# Altium schematic sheet Sheet1.SchDoc
size E
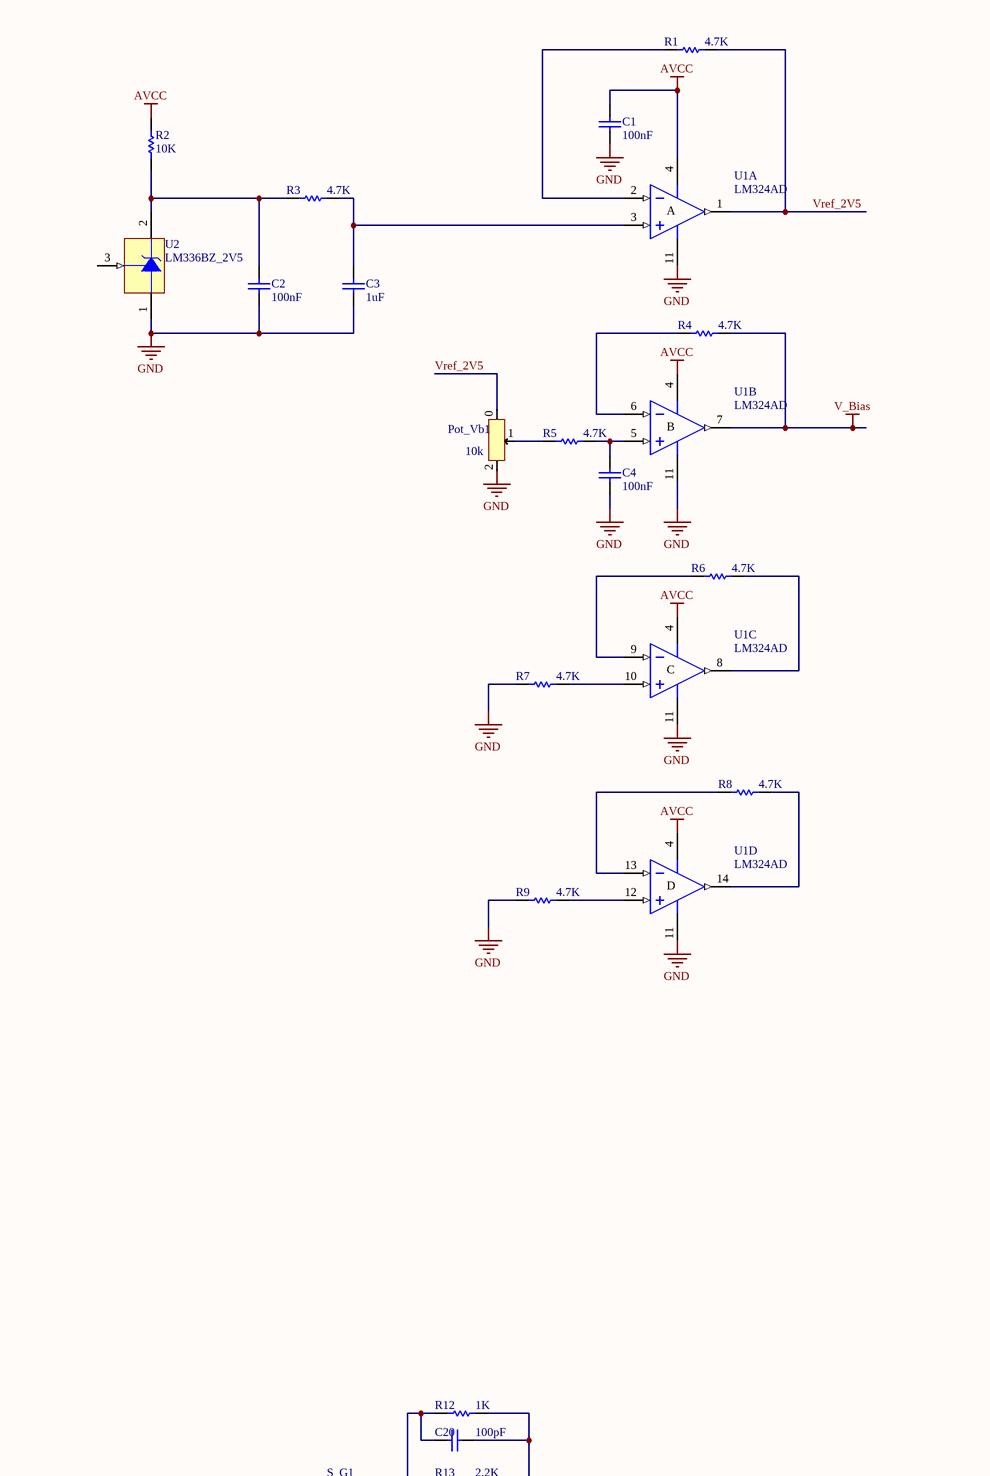
[diagram p0: Sheet1.SchDoc, top left]
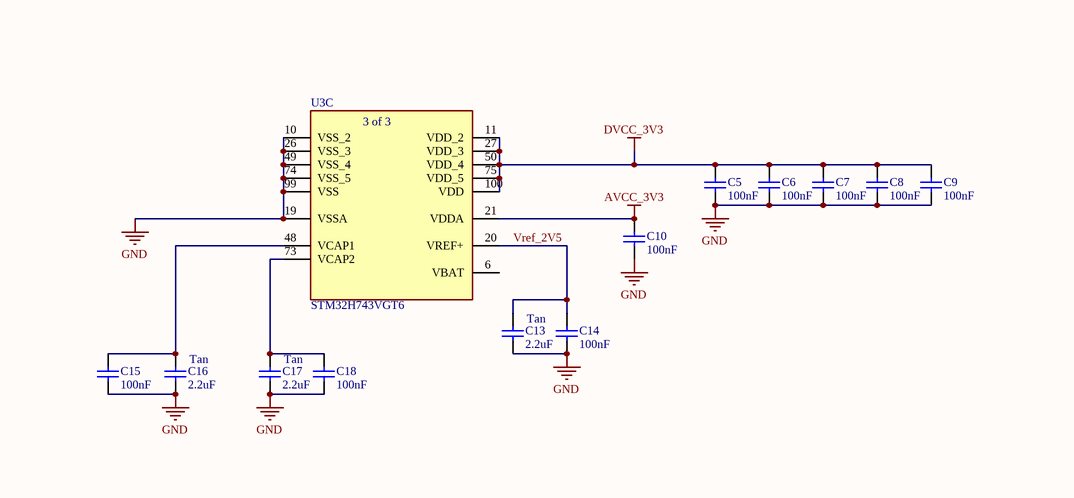
[diagram p1: Sheet1.SchDoc, top middle]
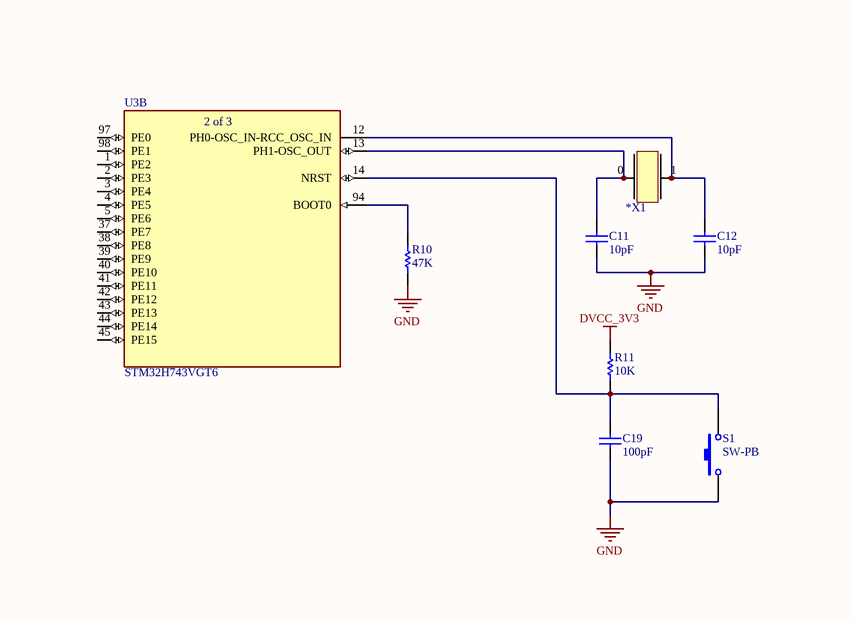
[diagram p2: Sheet1.SchDoc, top right]
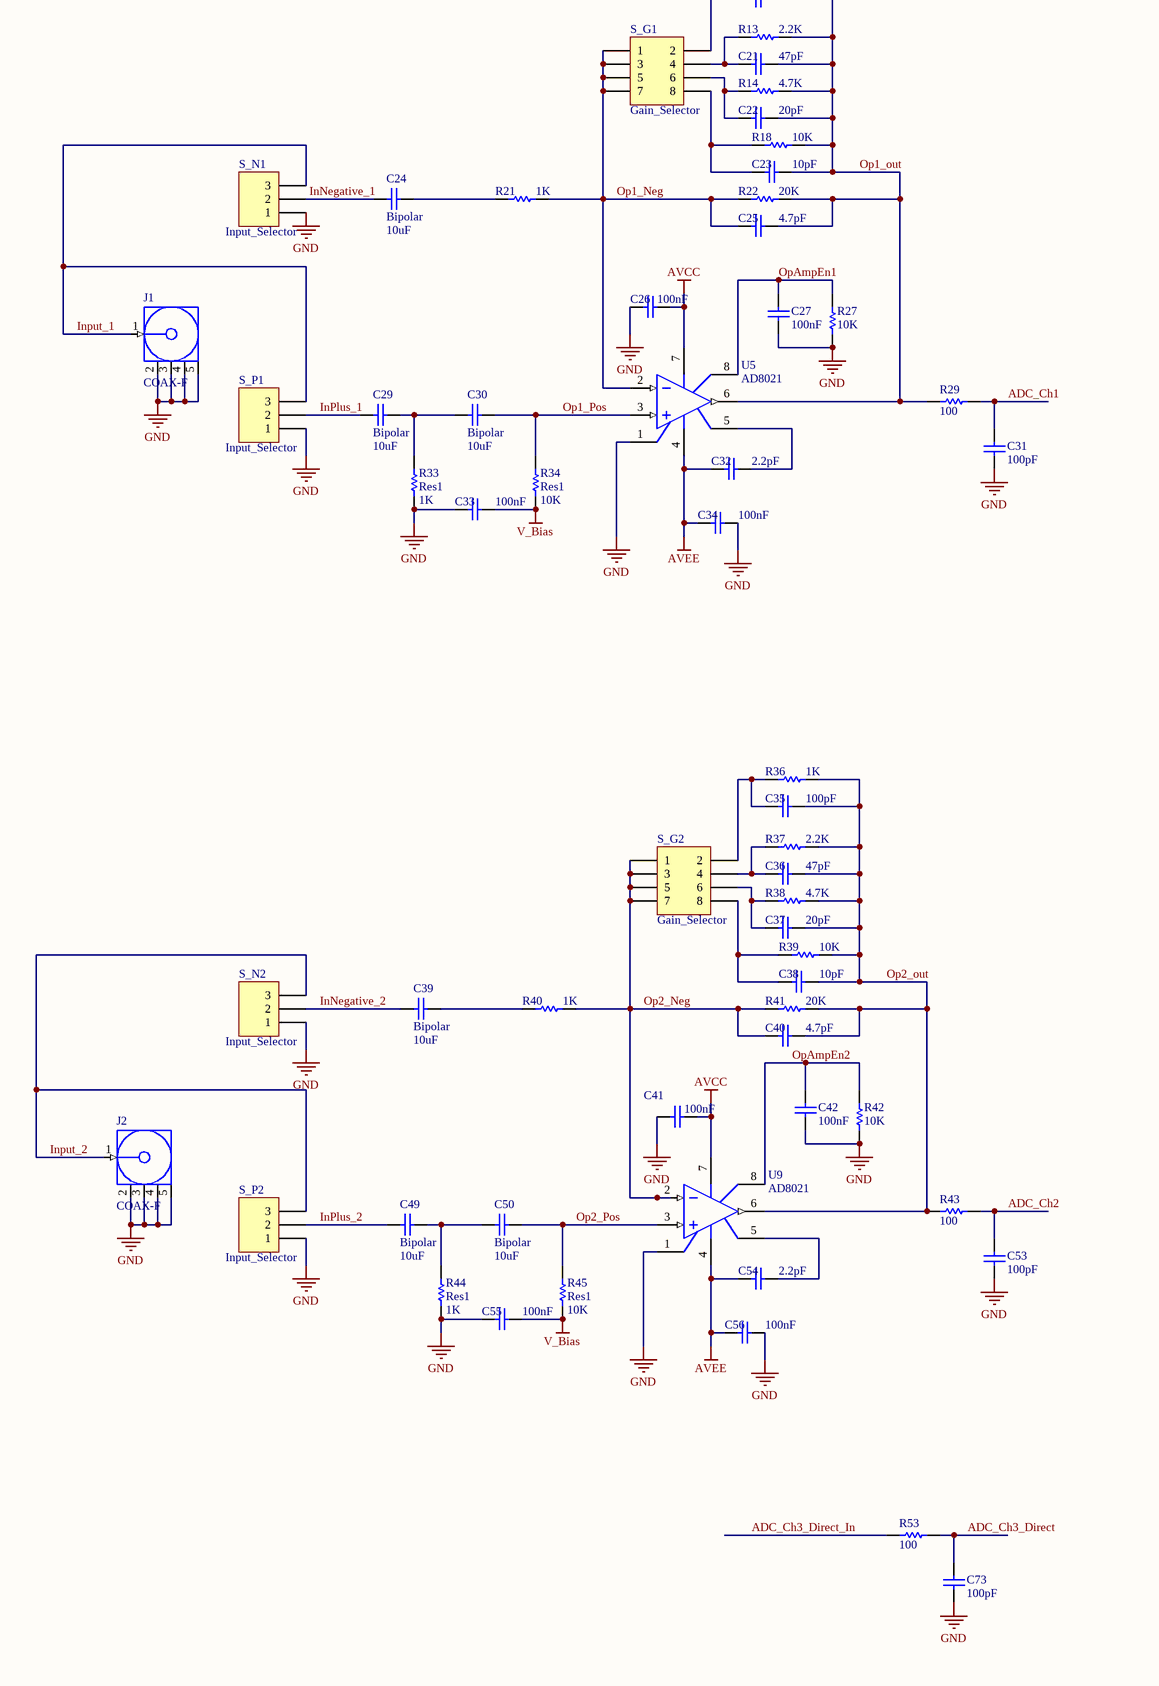
[diagram p3: Sheet1.SchDoc, bottom left]
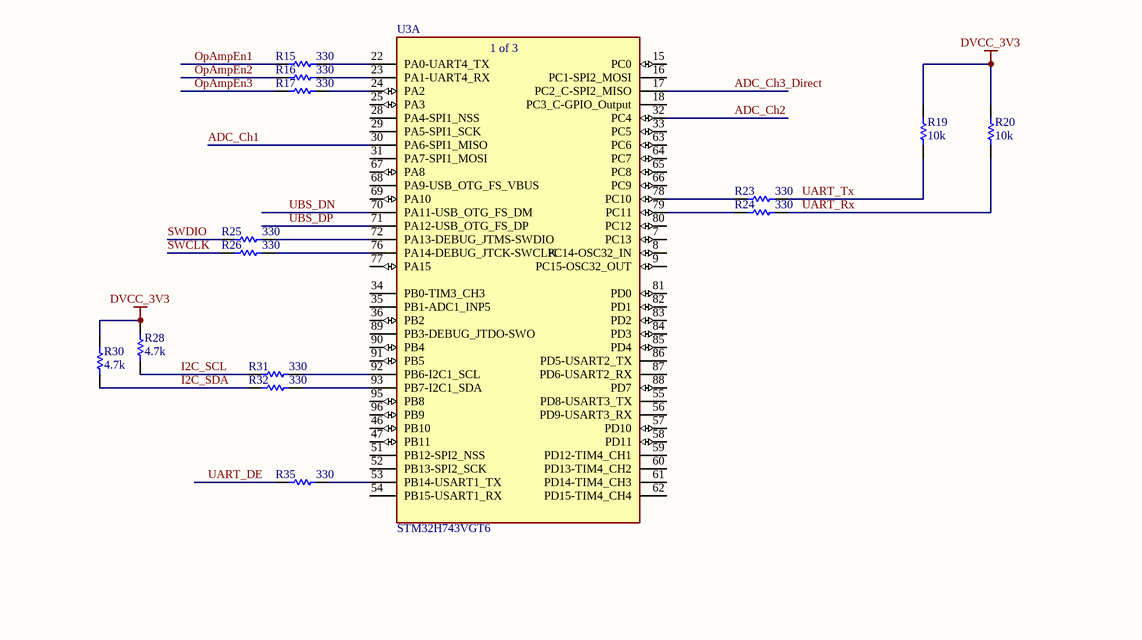
[diagram p4: Sheet1.SchDoc, bottom middle]
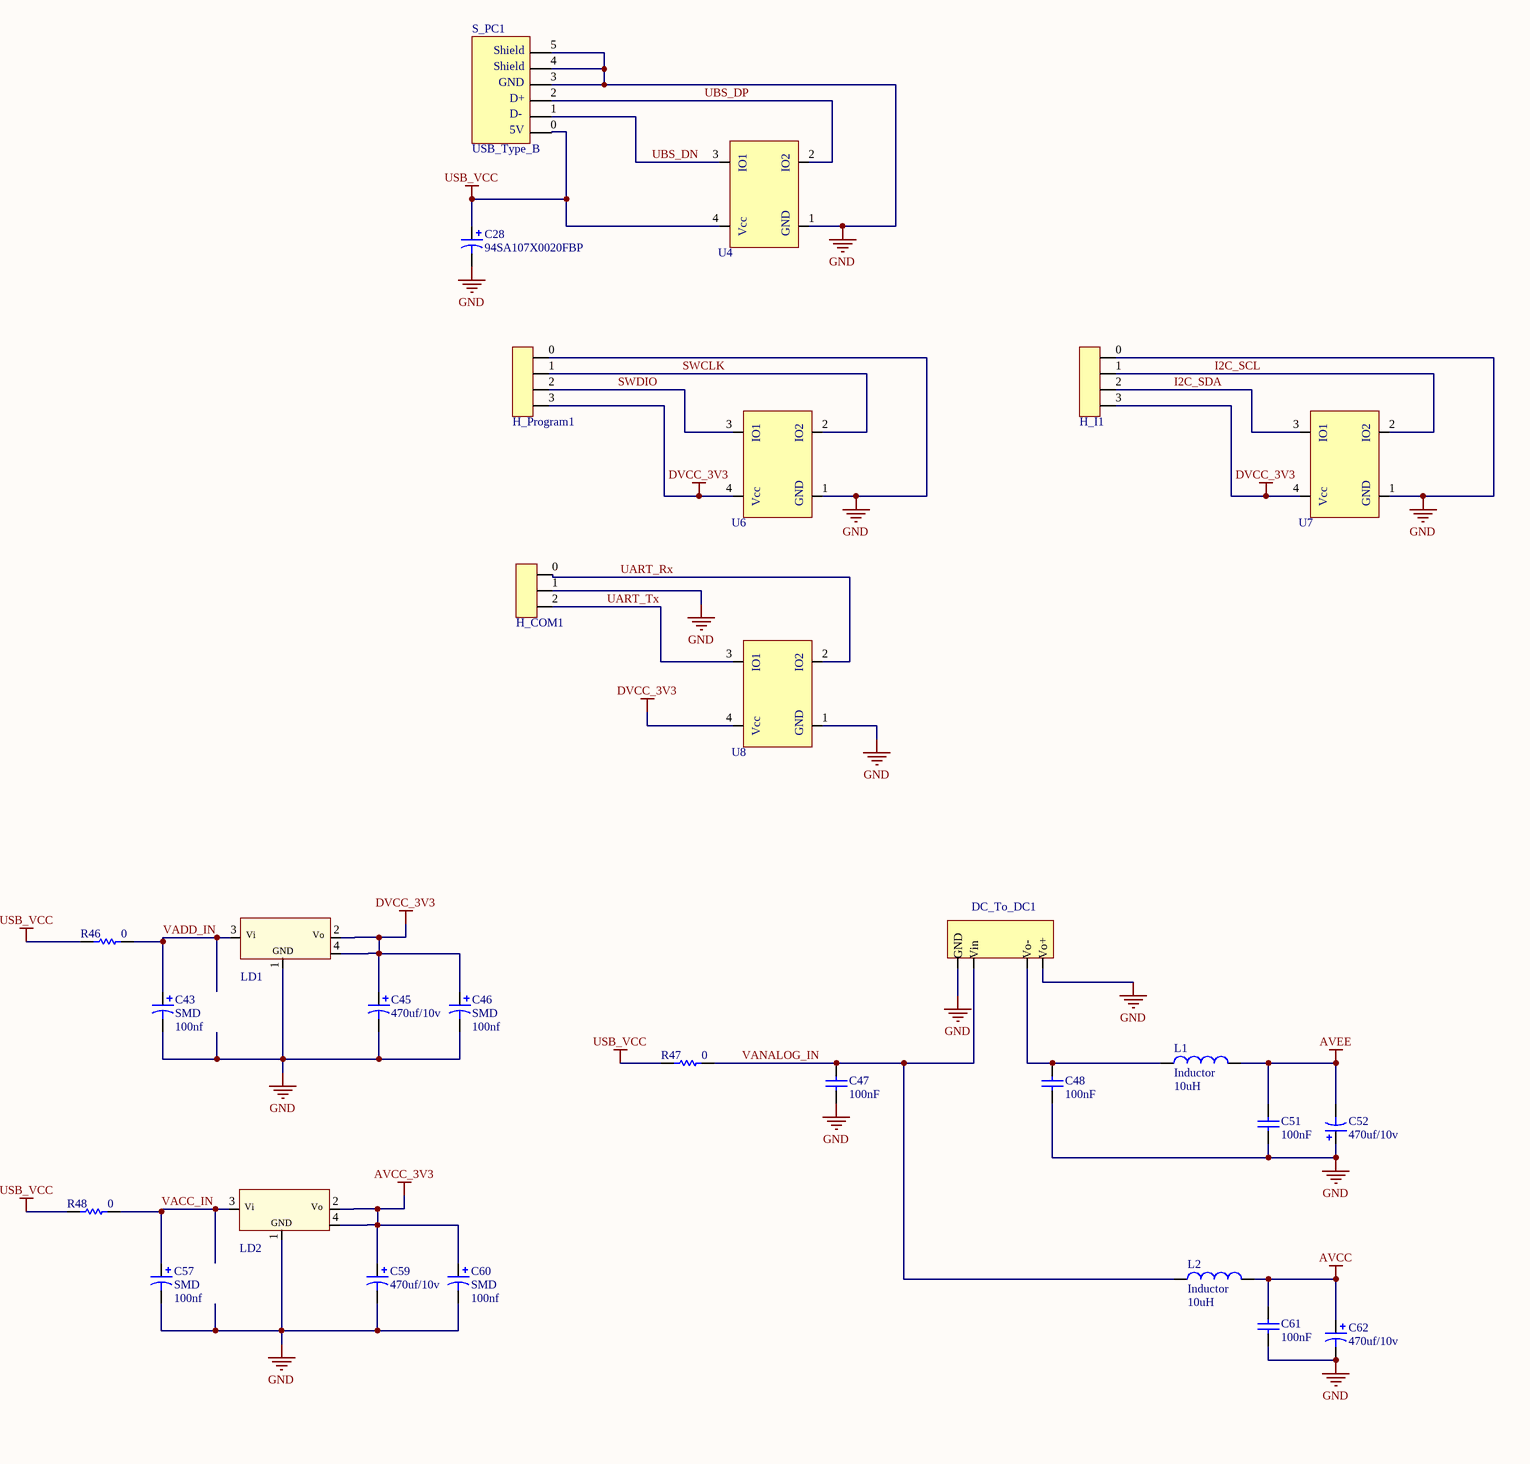
[diagram p5: Sheet1.SchDoc, bottom right]

## Parts
*X1  XTAl_Large  [XTAL_Large]  (value not drawn)
C1  value 100nF  [C0805]  (hidden comment: Bipolar)
C2  value 100nF  [C0805]  (hidden comment: Bipolar)
C3  value 1uF  [C0805]  (hidden comment: Bipolar)
C4  value 100nF  [C0805]  (hidden comment: Bipolar)
C5  value 100nF  [C0805]  (hidden comment: Bipolar)
C6  value 100nF  [C0805]  (hidden comment: Bipolar)
C7  value 100nF  [C0805]  (hidden comment: Bipolar)
C8  value 100nF  [C0805]  (hidden comment: Bipolar)
C9  value 100nF  [C0805]  (hidden comment: Bipolar)
C10  value 100nF  [C0805]  (hidden comment: Bipolar)
C11  value 10pF  [C0805]  (hidden comment: Bipolar)
C12  value 10pF  [C0805]  (hidden comment: Bipolar)
C13  Tan  value 2.2uF  [C1210]
C14  value 100nF  [C0805]  (hidden comment: Bipolar)
C15  value 100nF  [C0805]  (hidden comment: Bipolar)
C16  Tan  value 2.2uF  [C1210]
C17  Tan  value 2.2uF  [C1210]
C18  value 100nF  [C0805]  (hidden comment: Bipolar)
C19  value 100pF  [C0805]  (hidden comment: Bipolar)
C20  value 100pF  [C0805]  (hidden comment: Bipolar)
C21  value 47pF  [C0805]  (hidden comment: Bipolar)
C22  value 20pF  [C0805]  (hidden comment: Bipolar)
C23  value 10pF  [C0805]  (hidden comment: Bipolar)
C24  Bipolar  value 10uF  [HA-N3]
C25  value 4.7pF  [C0805]  (hidden comment: Bipolar)
C26  value 100nF  [C0805]  (hidden comment: Bipolar)
C27  value 100nF  [C0805]  (hidden comment: Bipolar)
C28  94SA107X0020FBP  [F]
C29  Bipolar  value 10uF  [HA-N3]
C30  Bipolar  value 10uF  [HA-N3]
C31  value 100pF  [C0805]  (hidden comment: Bipolar)
C32  value 2.2pF  [C0805]  (hidden comment: Bipolar)
C33  value 100nF  [C0805]  (hidden comment: Bipolar)
C34  value 100nF  [C0805]  (hidden comment: Bipolar)
C35  value 100pF  [C0805]  (hidden comment: Bipolar)
C36  value 47pF  [C0805]  (hidden comment: Bipolar)
C37  value 20pF  [C0805]  (hidden comment: Bipolar)
C38  value 10pF  [C0805]  (hidden comment: Bipolar)
C39  Bipolar  value 10uF  [HA-N3]
C40  value 4.7pF  [C0805]  (hidden comment: Bipolar)
C41  value 100nF  [C0805]  (hidden comment: Bipolar)
C42  value 100nF  [C0805]  (hidden comment: Bipolar)
C43  SMD  value 100nf  [C0805]
C45  470uf/10v  [CAPPR3.5-8X11.5]
C46  SMD  value 100nf  [C0805]
C47  value 100nF  [C0805]  (hidden comment: Bipolar)
C48  value 100nF  [C0805]  (hidden comment: Bipolar)
C49  Bipolar  value 10uF  [HA-N3]
C50  Bipolar  value 10uF  [HA-N3]
C51  value 100nF  [C0805]  (hidden comment: Bipolar)
C52  470uf/10v  [CAPPR3.5-8X11.5]
C53  value 100pF  [C0805]  (hidden comment: Bipolar)
C54  value 2.2pF  [C0805]  (hidden comment: Bipolar)
C55  value 100nF  [C0805]  (hidden comment: Bipolar)
C56  value 100nF  [C0805]  (hidden comment: Bipolar)
C57  SMD  value 100nf  [C0805]
C59  470uf/10v  [CAPPR3.5-8X11.5]
C60  SMD  value 100nf  [C0805]
C61  value 100nF  [C0805]  (hidden comment: Bipolar)
C62  470uf/10v  [CAPPR3.5-8X11.5]
C73  value 100pF  [C0805]  (hidden comment: Bipolar)
DC_To_DC1  DC_To_DC  [DC_To_DC]  (value not drawn)
H_COM1  Header_3Pin  [Header_3Pin]  (value not drawn)
H_I1  Header_4Pin  [Header_4Pin]  (value not drawn)
H_Program1  Header_4Pin  [Header_4Pin]  (value not drawn)
J1  COAX-F  [MCX5.08-H5]
J2  COAX-F  [MCX5.08-H5]
L1  Inductor  value 10uH  [6-0805_M]
L2  Inductor  value 10uH  [6-0805_M]
LD1  LD33  [SOT230P]  (value not drawn)
LD2  LD33  [SOT230P]  (value not drawn)
Pot_Vb1  10k  [MultiTurn]
R1  value 4.7K  [6-0805_L]  (hidden comment: Res1)
R2  value 10K  [6-0805_L]  (hidden comment: Res1)
R3  value 4.7K  [6-0805_L]  (hidden comment: Res1)
R4  value 4.7K  [6-0805_L]  (hidden comment: Res1)
R5  value 4.7K  [6-0805_L]  (hidden comment: Res1)
R6  value 4.7K  [6-0805_L]  (hidden comment: Res1)
R7  value 4.7K  [6-0805_L]  (hidden comment: Res1)
R8  value 4.7K  [6-0805_L]  (hidden comment: Res1)
R9  value 4.7K  [6-0805_L]  (hidden comment: Res1)
R10  value 47K  [6-0805_L]  (hidden comment: Res1)
R11  value 10K  [6-0805_L]  (hidden comment: Res1)
R12  value 1K  [6-0805_L]  (hidden comment: Res1)
R13  value 2.2K  [6-0805_L]  (hidden comment: Res1)
R14  value 4.7K  [6-0805_L]  (hidden comment: Res1)
R15  value 330  [6-0805_L]  (hidden comment: Res1)
R16  value 330  [6-0805_L]  (hidden comment: Res1)
R17  value 330  [6-0805_L]  (hidden comment: Res1)
R18  value 10K  [6-0805_L]  (hidden comment: Res1)
R19  value 10k  [6-0805_L]  (hidden comment: Res1)
R20  value 10k  [6-0805_L]  (hidden comment: Res1)
R21  value 1K  [6-0805_L]  (hidden comment: Res1)
R22  value 20K  [6-0805_L]  (hidden comment: Res1)
R23  value 330  [6-0805_L]  (hidden comment: Res1)
R24  value 330  [6-0805_L]  (hidden comment: Res1)
R25  value 330  [6-0805_L]  (hidden comment: Res1)
R26  value 330  [6-0805_L]  (hidden comment: Res1)
R27  value 10K  [6-0805_L]  (hidden comment: Res1)
R28  value 4.7k  [6-0805_L]  (hidden comment: Res1)
R29  value 100  [6-0805_L]  (hidden comment: Res1)
R30  value 4.7k  [6-0805_L]  (hidden comment: Res1)
R31  value 330  [6-0805_L]  (hidden comment: Res1)
R32  value 330  [6-0805_L]  (hidden comment: Res1)
R33  Res1  value 1K  [6-0805_L]
R34  Res1  value 10K  [6-0805_L]
R35  value 330  [6-0805_L]  (hidden comment: Res1)
R36  value 1K  [6-0805_L]  (hidden comment: Res1)
R37  value 2.2K  [6-0805_L]  (hidden comment: Res1)
R38  value 4.7K  [6-0805_L]  (hidden comment: Res1)
R39  value 10K  [6-0805_L]  (hidden comment: Res1)
R40  value 1K  [6-0805_L]  (hidden comment: Res1)
R41  value 20K  [6-0805_L]  (hidden comment: Res1)
R42  value 10K  [6-0805_L]  (hidden comment: Res1)
R43  value 100  [6-0805_L]  (hidden comment: Res1)
R44  Res1  value 1K  [6-0805_L]
R45  Res1  value 10K  [6-0805_L]
R46  value 0  [6-0805_L]  (hidden comment: Res1)
R47  value 0  [6-0805_L]  (hidden comment: Res1)
R48  value 0  [6-0805_L]  (hidden comment: Res1)
R53  value 100  [6-0805_L]  (hidden comment: Res1)
S1  SW-PB  [SPST-2]
S_G1  Gain_Selector  [HDR2X4]
S_G2  Gain_Selector  [HDR2X4]
S_N1  Input_Selector  [HDR1X3]
S_N2  Input_Selector  [HDR1X3]
S_P1  Input_Selector  [HDR1X3]
S_P2  Input_Selector  [HDR1X3]
S_PC1  USB_Type_B  [USB_Type_B]
U1  LM324AD  [SO14_N]  (parts A,B,C,D of 4)
U2  LM336BZ_2V5  [TO92]
U3  STM32H743VGT6  [QFP50P1600X1600X160-100N]  (parts A,B,C of 3)
U4  PRTR5V  [SOT143L]  (value not drawn)
U5  AD8021  [SO8_N]
U6  PRTR5V  [SOT143L]  (value not drawn)
U7  PRTR5V  [SOT143L]  (value not drawn)
U8  PRTR5V  [SOT143L]  (value not drawn)
U9  AD8021  [SO8_N]

## Nets
AVCC: C1.2 C26.2 C41.2 C61.2 C62.1 L2.2 R2.2 U1.4(V+) U5.7(V+) U9.7(V+)
AVCC_3V3: C10.2 C59.1 C60.1 LD2.2(Vo) LD2.4(Vo) U3.21(VDDA)
AVEE: C32.1 C34.1 C51.2 C52.2 C54.1 C56.1 L1.2 U5.4(V-) U9.4(V-)
DVCC_3V3: C5.2 C6.2 C7.2 C8.2 C9.2 C45.1 C46.1 H_I1.3 H_Program1.3 LD1.2(Vo) LD1.4(Vo) R11.2 R19.2 R20.2 R28.2 R30.2 U3.11(VDD_2) U3.27(VDD_3) U3.50(VDD_4) U3.75(VDD_5) U3.100(VDD) U6.4 U7.4 U8.4
GND: C1.1 C2.1 C3.1 C4.1 C5.1 C6.1 C7.1 C8.1 C9.1 C10.1 C11.1 C12.1 C13.1 C14.1 C15.1 C16.1 C17.1 C18.1 C19.1 C26.1 C27.1 C28.2 C31.1 C33.1 C34.2 C41.1 C42.1 C43.2 C45.2 C46.2 C47.1 C48.1 C51.1 C52.1 C53.1 C55.1 C56.2 C57.2 C59.2 C60.2 C61.1 C62.2 C73.1 DC_To_DC1.0(GND) DC_To_DC1.3(Vo+) H_COM1.1 H_I1.0 H_Program1.0 J1.2(GND) J1.3(GND) J1.4(GND) J1.5(GND) J2.2(GND) J2.3(GND) J2.4(GND) J2.5(GND) LD1.1(GND) LD2.1(GND) Pot_Vb1.2 R7.1 R9.1 R10.2 R27.1 R33.1 R42.1 R44.1 S1.1 S_N1.1 S_N2.1 S_P1.1 S_P2.1 S_PC1.3 S_PC1.4 S_PC1.5 U1.11(V-) U2.1(-V) U3.10(VSS_2) U3.19(VSSA) U3.26(VSS_3) U3.49(VSS_4) U3.74(VSS_5) U3.99(VSS) U4.1 U5.1(OS_NULL) U6.1 U7.1 U8.1 U9.1(OS_NULL)
USB_VCC: C28.1 R46.1 R47.1 R48.1 S_PC1.0 U4.4
V_Bias: C33.2 C55.2 R4.2 R34.1 R45.1 U1.7(OUT)
ADC_Ch1: C31.2 R29.1 U3.30(PA6-SPI1_MISO)
ADC_Ch2: C53.2 R43.1 U3.32(PC4)
ADC_Ch3_Direct: C73.2 R53.1 U3.17(PC2_C-SPI2_MISO)
ADC_Ch3_Direct_In: R53.2
I2C_SCL: H_I1.1 R28.1 R31.1 U7.2
I2C_SDA: H_I1.2 R30.1 R32.1 U7.3
InNegative_1: C24.1 S_N1.2
InNegative_2: C39.1 S_N2.2
InPlus_1: C29.1 S_P1.2
InPlus_2: C49.1 S_P2.2
Input_1: J1.1(Signal) S_N1.3 S_P1.3
Input_2: J2.1(Signal) S_N2.3 S_P2.3
Op1_Neg: C25.1 R21.2 R22.1 S_G1.1 S_G1.3 S_G1.5 S_G1.7 U5.2(IN-)
Op1_out: C20.2 C21.2 C22.2 C23.2 C25.2 R12.2 R13.2 R14.2 R18.2 R22.2 R29.2 U5.6(OUT)
Op1_Pos: C30.2 R34.2 U5.3(IN+)
Op2_Neg: C40.1 R40.2 R41.1 S_G2.1 S_G2.3 S_G2.5 S_G2.7 U9.2(IN-)
Op2_out: C35.2 C36.2 C37.2 C38.2 C40.2 R36.2 R37.2 R38.2 R39.2 R41.2 R43.2 U9.6(OUT)
Op2_Pos: C50.2 R45.2 U9.3(IN+)
OpAmpEn1: C27.2 R15.1 R27.2 U5.8(NC)
OpAmpEn2: C42.2 R16.1 R42.2 U9.8(NC)
OpAmpEn3: R17.1
SWCLK: H_Program1.1 R26.1 U6.2
SWDIO: H_Program1.2 R25.1 U6.3
UART_DE: R35.1
UART_Rx: H_COM1.0 R20.1 R24.2 U8.2
UART_Tx: H_COM1.2 R19.1 R23.2 U8.3
UBS_DN: S_PC1.1 U3.70(PA11-USB_OTG_FS_DM) U4.3
UBS_DP: S_PC1.2 U3.71(PA12-USB_OTG_FS_DP) U4.2
VACC_IN: C57.1 LD2.3(Vi) R48.2
VADD_IN: C43.1 LD1.3(Vi) R46.2
VANALOG_IN: C47.2 DC_To_DC1.1(Vin) L2.1 R47.2
Vref_2V5: C13.2 C14.2 Pot_Vb1.0 R1.2 U1.1(OUT) U3.20(VREF+)
Net*X1_0: *X1.0 C11.2 U3.13(PH1-OSC_OUT)
Net*X1_1: *X1.1 C12.2 U3.12(PH0-OSC_IN-RCC_OSC_IN)
NetC2_2: C2.2 R2.1 R3.1 U2.2(+V)
NetC3_2: C3.2 R3.2 U1.3(IN+)
NetC4_2: C4.2 R5.2 U1.5(IN+)
NetC15_2: C15.2 C16.2 U3.48(VCAP1)
NetC17_2: C17.2 C18.2 U3.73(VCAP2)
NetC19_2: C19.2 R11.1 S1.2 U3.14(NRST)
NetC20_1: C20.1 R12.1 S_G1.2
NetC21_1: C21.1 R13.1 S_G1.4
NetC22_1: C22.1 R14.1 S_G1.6
NetC23_1: C23.1 R18.1 S_G1.8
NetC24_2: C24.2 R21.1
NetC29_2: C29.2 C30.1 R33.2
NetC32_2: C32.2 U5.5(OS_NULL)
NetC35_1: C35.1 R36.1 S_G2.2
NetC36_1: C36.1 R37.1 S_G2.4
NetC37_1: C37.1 R38.1 S_G2.6
NetC38_1: C38.1 R39.1 S_G2.8
NetC39_2: C39.2 R40.1
NetC48_2: C48.2 DC_To_DC1.2(Vo-) L1.1
NetC49_2: C49.2 C50.1 R44.2
NetC54_2: C54.2 U9.5(OS_NULL)
NetPot_Vb1_1: Pot_Vb1.1 R5.1
NetR1_1: R1.1 U1.2(IN-)
NetR4_1: R4.1 U1.6(IN-)
NetR6_1: R6.1 U1.9(IN-)
NetR6_2: R6.2 U1.8(OUT)
NetR7_2: R7.2 U1.10(IN+)
NetR8_1: R8.1 U1.13(IN-)
NetR8_2: R8.2 U1.14(OUT)
NetR9_2: R9.2 U1.12(IN+)
NetR10_1: R10.1 U3.94(BOOT0)
NetR15_2: R15.2 U3.22(PA0-UART4_TX)
NetR16_2: R16.2 U3.23(PA1-UART4_RX)
NetR17_2: R17.2 U3.24(PA2)
NetR23_1: R23.1 U3.78(PC10)
NetR24_1: R24.1 U3.79(PC11)
NetR25_2: R25.2 U3.72(PA13-DEBUG_JTMS-SWDIO)
NetR26_2: R26.2 U3.76(PA14-DEBUG_JTCK-SWCLK)
NetR31_2: R31.2 U3.92(PB6-I2C1_SCL)
NetR32_2: R32.2 U3.93(PB7-I2C1_SDA)
NetR35_2: R35.2 U3.53(PB14-USART1_TX)

Not connected (* = marked no-connect by the designer): U2 3(ADJ); U3 1(PE2) 2(PE3) 3(PE4) 4(PE5) 5(PE6) 6(VBAT) 7(PC13) 8(PC14-OSC32_IN) 9(PC15-OSC32_OUT) 15(PC0) 16(PC1-SPI2_MOSI) 18(PC3_C-GPIO_Output) 25(PA3) 28(PA4-SPI1_NSS) 29(PA5-SPI1_SCK) 31(PA7-SPI1_MOSI) 33(PC5) 34(PB0-TIM3_CH3) 35(PB1-ADC1_INP5) 36(PB2) 37(PE7) 38(PE8) 39(PE9) 40(PE10) 41(PE11) 42(PE12) 43(PE13) 44(PE14) 45(PE15) 46(PB10) 47(PB11) 51(PB12-SPI2_NSS) 52(PB13-SPI2_SCK) 54(PB15-USART1_RX) 55(PD8-USART3_TX) 56(PD9-USART3_RX) 57(PD10) 58(PD11) 59(PD12-TIM4_CH1) 60(PD13-TIM4_CH2) 61(PD14-TIM4_CH3) 62(PD15-TIM4_CH4) 63(PC6) 64(PC7) 65(PC8) 66(PC9) 67(PA8) 68(PA9-USB_OTG_FS_VBUS) 69(PA10) 77(PA15) 80(PC12) 81(PD0) 82(PD1) 83(PD2) 84(PD3) 85(PD4) 86(PD5-USART2_TX) 87(PD6-USART2_RX) 88(PD7) 89(PB3-DEBUG_JTDO-SWO) 90(PB4) 91(PB5) 95(PB8) 96(PB9) 97(PE0) 98(PE1)

## Notes on the sheet
- (in symbol LM324AD, part A) A
- (in symbol LM324AD, part B) B
- (in symbol LM324AD, part C) C
- (in symbol LM324AD, part D) D
- (in symbol PRTR5V) IO1; IO2; Vcc; GND
- (in symbol STM32H743VGT6, part A) 1 of 3
- (in symbol STM32H743VGT6, part B) 2 of 3
- (in symbol STM32H743VGT6, part C) 3 of 3
- (in symbol USB_Type_B) Shield; GND; D+; D-; 5V

## Library data of the parts
C1-C27 C29-C42 C47-C51 C53-C56 C61 C73 = Cap: Capacitor; Published: 8-Jun-2000; LatestRevisionDate: 17-Jul-2002; LatestRevisionNote: Re-released for DXP Platform.; PackageReference: RAD-0.3; Publisher: Altium Limited; PackageDescription: Radial Cap, Thru-Hole; 2 Leads; 0.3 in Pin Spacing
C28 = 94SA107X0020FBP: Solid Aluminum Capacitor with Organic Semiconductor Electrolyte: 100uF, 20V, Bulk Pack; Note: Part Numbers shown are for ± 20% capacitance tolerance (X0).; PCB_Layout: Complies with Manufacturer's Recommendation.; DrillSize: Nominal, Rounded to the nearest 0.1mm; Published: 19-Mar-2004; DatasheetDocument: 29-Jun-2001; PackageReference: F; Publisher: Altium Limited; ComponentLink1Description: Manufacturer Link; ComponentLink1URL: http://www.vishay.com/; ComponentLink2Description: Datasheet; ComponentLink2URL: http://www.vishay.com/docs/90003/94sa.pdf; Value: 100uF
C43 C46 C57 C60 = Cap Pol3: Polarized Capacitor (Surface Mount); Published: 8-Jun-2000; LatestRevisionDate: 29-May-2009; LatestRevisionNote: IPC-7351 Footprint Added.; PackageReference: C0805; Publisher: Altium Limited; PackageDescription: Chip Capacitor
C45 C52 C59 C62 = EKA00DC347D00: Aluminum Electrolytic Capacitor, Radial Style with Long Leads: 470uF, 16V; Note: Refer to Manufacturer's Data Sheets for other lead formations; DrillSize: Nominal, Rounded To The Nearest 0.1mm; Published: 19-Mar-2004; DatasheetDocument: 20-Feb-2001; PackageReference: CAPPR3.5-8X11.5; Publisher: Altium Limited; ComponentLink1Description: Manufacturer Link; ComponentLink1URL: http://www.vishay.com/; ComponentLink2Description: Datasheet; ComponentLink2URL: http://www.vishay.com/docs/25014/eka.pdf; Value: 470uF
J1 J2 = COAX-F: RF Coaxial PCB Connector, MCX; Thru-Hole, Right-Angle Mount Socket, Blunt Post Terminal, 50 Ohm Impedance; PCB_Layout: Complies with manufacturer's recommendation.; DrillSize: Corresponds to nominal value.; Published: 15-Jul-2004; LatestRevisionDate: 15-Jul-2004; LatestRevisionNote: Component Replaced.; DatasheetDocument: 30-May-2003; PackageDocument: 04-Jul-1999; PackageReference: 919-119J-51AX; Publisher: Altium Limited; ComponentLink1Description: Manufacturer Link; ComponentLink1URL: http://www.amphenolrf.com/
L1 L2 = Inductor: Code_IEC: 1005; Published: 8-Jun-2000; LatestRevisionDate: 29-May-2009; LatestRevisionNote: IPC-7351 Footprint Added.; PackageReference: 0402-A; Publisher: Altium Limited; PackageDescription: Chip Inductor; Code_JEITA: 0402
Pot_Vb1 = Pot
R1-R48 R53 = Res1: Resistor; Published: 8-Jun-2000; LatestRevisionDate: 17-Jul-2002; LatestRevisionNote: Re-released for DXP Platform.; PackageReference: AXIAL-0.3; Publisher: Altium Limited; PackageDescription: Axial Device, Thru-Hole; 2 Leads; 0.3 in Pin Spacing
S1 = SW-PB: Switch; Published: 24-Mar-1999; LatestRevisionDate: 17-Jul-2002; LatestRevisionNote: Re-released for DXP Platform.; PackageReference: SPST-2; Publisher: Altium Limited; PackageDescription: Switch; 2 Leads
S_G1 S_G2 = Header 4X2: Header, 4-Pin, Dual row; LatestRevisionDate: 17-Jul-2002; LatestRevisionNote: Re-released for DXP Platform.; Publisher: Altium Limited
S_N1 S_N2 S_P1 S_P2 = Header 3: Header, 3-Pin; LatestRevisionDate: 17-Jul-2002; LatestRevisionNote: Re-released for DXP Platform.; Publisher: Altium Limited
U1 = LM324AD: Low-Power Quad Operational Amplifier; Published: 24-Aug-2001; LatestRevisionDate: 13-Apr-2006; LatestRevisionNote: IPC-7351 Footprint Added.; DatasheetVersion: Nov-1997; PackageVersion: Sep-1998; PackageReference: SO14; Publisher: Altium Limited; PackageDescription: 14-Pin Small Outline Integrated Circuit 1.27 mm Pitch; Code_IPC: SOIC127P600-14; ComponentLink1Description: Manufacturer Link; ComponentLink1URL: http://www.st.com/; ComponentLink2Description: Datasheet; ComponentLink2URL: http://www.st.com/stonline/products/literature/ds/4797/lm224a.pdf
U2 = LM336BZ: 2.5V Voltage Reference; Published: 24-Aug-2001; LatestRevisionDate: 17-Jul-2002; LatestRevisionNote: Re-released for DXP Platform.; DatasheetVersion: Oct-1997; PackageReference: TO92; Publisher: Altium Limited; PackageDescription: TO, Flat Index; 3 In-Line, Axial Leads; Body Dia. 4.8mm; Leads 0.51 x 0.51 mm (max); ComponentLink1Description: Manufacturer Link; ComponentLink1URL: http://www.st.com/; ComponentLink2Description: Datasheet; ComponentLink2URL: http://www.st.com/stonline/products/literature/ds/2166/lm336.pdf
U3 = STM32H743VGT6: ARMÂ® CortexÂ®-M7 STM32H7 Microcontroller IC 32-Bit Single-Core 480MHz 1MB (1M x 8) FLASH 100-LQFP (14x14); MF: STMicroelectronics; SnapEDA_Link: https://www.snapeda.com/parts/STM32H743VGT6/STMicroelectronics/view-part/?ref=snap; Package: None; Value: *; MP: STM32H743VGT6; Check_prices: https://www.snapeda.com/parts/STM32H743VGT6/STMicroelectronics/view-part/?ref=eda
U5 U9 = MC33001D: General-Purpose Single J-FET Operational Amplifier; Published: 24-Aug-2001; LatestRevisionDate: 13-Apr-2006; LatestRevisionNote: IPC-7351 Footprint Added.; DatasheetVersion: Apr-1995; PackageVersion: Dec-2002; PackageReference: SO8; Publisher: Altium Limited; PackageDescription: 8-Pin Small Outline Integrated Circuit 1.27 mm Pitch; Code_JEDEC: MS-012-AA; Code_IPC: SOIC127P600-8; ComponentLink1Description: Manufacturer Link; ComponentLink1URL: http://www.st.com/